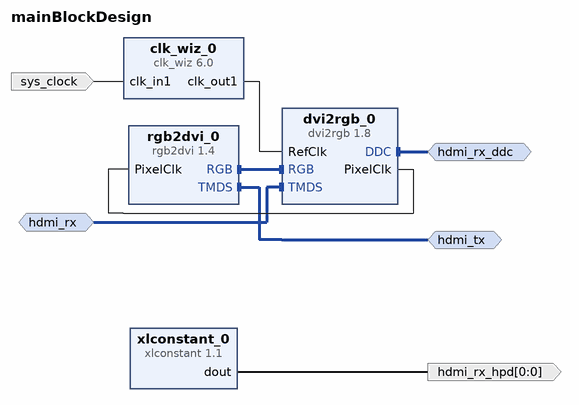
[diagram p0: block diagram of the top level]
# Vivado block design mainBlockDesign, xc7z020clg400-1, Vivado 2018.2
create_bd_design mainBlockDesign

create_bd_intf_port -mode Slave -vlnv digilentinc.com:interface:tmds_rtl:1.0 hdmi_rx
create_bd_intf_port -mode Master -vlnv digilentinc.com:interface:tmds_rtl:1.0 hdmi_tx
create_bd_intf_port -mode Master -vlnv xilinx.com:interface:iic_rtl:1.0 hdmi_rx_ddc
create_bd_port -dir O -from 0 -to 0 hdmi_rx_hpd
create_bd_port -dir I -type clk sys_clock
set_property -dict {CONFIG.FREQ_HZ 125000000 CONFIG.PHASE 0.000} [get_bd_ports sys_clock]

create_bd_cell -type ip -vlnv digilentinc.com:ip:dvi2rgb:1.8 dvi2rgb_0
set_property -dict [list \
  CONFIG.kEmulateDDC true \
  CONFIG.kEnableSerialClkOutput false \
  CONFIG.kRstActiveHigh true \
  CONFIG.kClkRange 1 \
  CONFIG.kEdidFileName dgl_1080p_cea.data \
] [get_bd_cells dvi2rgb_0]
create_bd_cell -type ip -vlnv xilinx.com:ip:clk_wiz:6.0 clk_wiz_0
set_property -dict [list \
  CONFIG.PRIMITIVE PLL \
  CONFIG.PRIM_IN_FREQ 125.000 \
  CONFIG.CLKIN1_JITTER_PS 80.0 \
  CONFIG.CLKOUT1_REQUESTED_OUT_FREQ 200 \
  CONFIG.CLKOUT1_DRIVES BUFG \
  CONFIG.CLKOUT2_DRIVES BUFG \
  CONFIG.CLKOUT3_DRIVES BUFG \
  CONFIG.CLKOUT4_DRIVES BUFG \
  CONFIG.CLKOUT5_DRIVES BUFG \
  CONFIG.CLKOUT6_DRIVES BUFG \
  CONFIG.CLKOUT7_DRIVES BUFG \
  CONFIG.FEEDBACK_SOURCE FDBK_AUTO \
  CONFIG.USE_LOCKED false \
  CONFIG.USE_RESET false \
  CONFIG.MMCM_DIVCLK_DIVIDE 1 \
  CONFIG.MMCM_CLKFBOUT_MULT_F 8 \
  CONFIG.MMCM_CLKIN1_PERIOD 8.000 \
  CONFIG.MMCM_CLKIN2_PERIOD 10.0 \
  CONFIG.MMCM_COMPENSATION ZHOLD \
  CONFIG.MMCM_CLKOUT0_DIVIDE_F 5 \
  CONFIG.USE_BOARD_FLOW true \
  CONFIG.CLK_IN1_BOARD_INTERFACE sys_clock \
  CONFIG.CLKOUT1_JITTER 109.241 \
  CONFIG.CLKOUT1_PHASE_ERROR 96.948 \
] [get_bd_cells clk_wiz_0]
create_bd_cell -type ip -vlnv digilentinc.com:ip:rgb2dvi:1.4 rgb2dvi_0
set_property -dict {CONFIG.kRstActiveHigh true CONFIG.kGenerateSerialClk true CONFIG.kClkRange 1} [get_bd_cells rgb2dvi_0]
create_bd_cell -type ip -vlnv xilinx.com:ip:xlconstant:1.1 xlconstant_0

# ---- connections ----

connect_bd_intf_net [get_bd_intf_pins rgb2dvi_0/RGB] [get_bd_intf_pins dvi2rgb_0/RGB]
connect_bd_intf_net [get_bd_intf_ports hdmi_rx] [get_bd_intf_pins dvi2rgb_0/TMDS]
connect_bd_intf_net [get_bd_intf_ports hdmi_tx] [get_bd_intf_pins rgb2dvi_0/TMDS]
connect_bd_intf_net [get_bd_intf_ports hdmi_rx_ddc] [get_bd_intf_pins dvi2rgb_0/DDC]
connect_bd_net [get_bd_pins clk_wiz_0/clk_out1] [get_bd_pins dvi2rgb_0/RefClk]
connect_bd_net [get_bd_pins dvi2rgb_0/PixelClk] [get_bd_pins rgb2dvi_0/PixelClk]
connect_bd_net [get_bd_pins xlconstant_0/dout] [get_bd_ports hdmi_rx_hpd]
connect_bd_net [get_bd_ports sys_clock] [get_bd_pins clk_wiz_0/clk_in1]

validate_bd_design
save_bd_design
